# Altium schematic sheet SOLID_LED.SchDoc
size A2
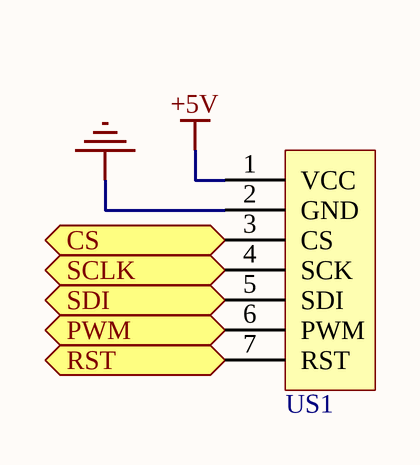
[diagram p0: SOLID_LED.SchDoc]

## Parts
US1  SOLID_LED1  [SOLID_LED1]  (value not drawn)

## Ports
CS, PWM, RST, SCLK, SDI

## Nets
+5V: US1.1(VCC)
GND: US1.2(GND)
CS: US1.3(CS) ; port CS
PWM: US1.6(PWM) ; port PWM
RST: US1.7(RST) ; port RST
SCLK: US1.4(SCK) ; port SCLK
SDI: US1.5(SDI) ; port SDI